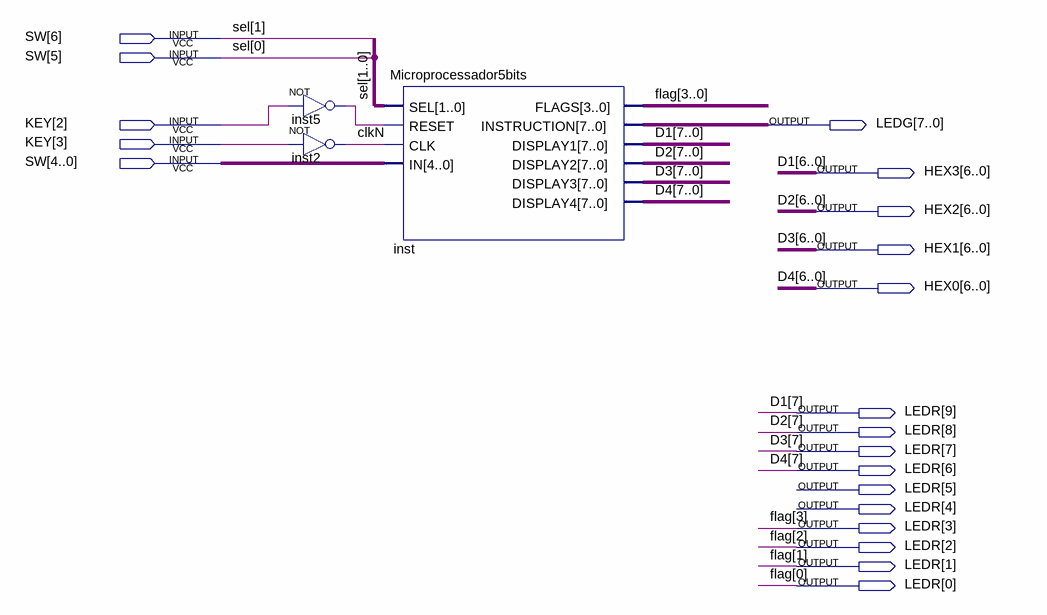
[diagram p0: schematic sheet]
// Quartus schematic Final.bdf as structural Verilog: 3 symbols, 20 pins
module Final (
  input  [6:0] SW,
  input  [3:2] KEY,
  output [7:0] LEDG,
  output [6:0] HEX3,
  output [6:0] HEX2,
  output [6:0] HEX1,
  output [6:0] HEX0,
  output [9:0] LEDR
);

  wire clkN, inst5_out;

  not inst5 (inst5_out, KEY[2]);
  not inst2 (clkN, KEY[3]);
  Microprocessador5bits inst (
    .SEL(SW[6:5]), .RESET(inst5_out), .CLK(clkN), .IN(SW[4:0]), .FLAGS(LEDR[3:0]), .INSTRUCTION(LEDG),
    .DISPLAY1({LEDR[9], HEX3}), .DISPLAY2({LEDR[8], HEX2}), .DISPLAY3({LEDR[7], HEX1}),
    .DISPLAY4({LEDR[6], HEX0}));

  // Other names for the same wires on the sheet: D1[7:0] = {LEDR[9], HEX3}; D2[7:0] = {LEDR[8], HEX2};
  //   D3[7:0] = {LEDR[7], HEX1}; D4[7:0] = {LEDR[6], HEX0}; flag[3:0] = LEDR[3:0]; sel[1:0] = SW[6:5]
endmodule
